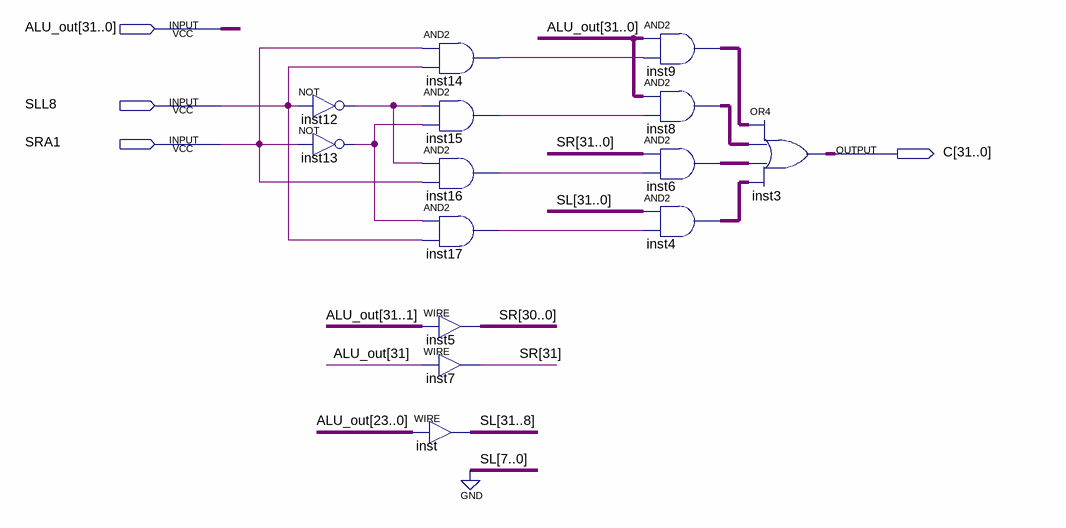
[diagram p0: schematic sheet]
// Quartus schematic SHIFTER.bdf as structural Verilog: 14 symbols, 4 pins
module SHIFTER (
  input  [31:0] ALU_out,
  input  SLL8,
  input  SRA1,
  output [31:0] C
);

  wire inst12_out, inst13_out, inst14_out, inst15_out, inst16_out, inst17_out;
  wire [31:0] inst4_out, inst6_out, inst8_out, inst9_out, SR;
  wire [31:8] SL;

  not inst12 (inst12_out, SLL8);
  not inst13 (inst13_out, SRA1);
  and inst14 (inst14_out, SRA1, SLL8);
  and inst15 (inst15_out, inst12_out, inst13_out);
  and inst16 (inst16_out, inst12_out, SRA1);
  and inst17 (inst17_out, inst13_out, SLL8);
  assign SR[30:0] = ALU_out[31:1];  // WIRE inst5
  assign SR[31] = ALU_out[31];  // WIRE inst7
  assign SL = ALU_out[23:0];  // WIRE inst
  assign inst9_out = ALU_out & {32{inst14_out}};  // AND2 inst9, 32 bits wide
  assign inst8_out = ALU_out & {32{inst15_out}};  // AND2 inst8, 32 bits wide
  assign inst6_out = SR & {32{inst16_out}};  // AND2 inst6, 32 bits wide
  assign inst4_out = {SL, {8{1'b0}}} & {32{inst17_out}};  // AND2 inst4, 32 bits wide
  assign C = inst9_out | inst8_out | inst6_out | inst4_out;  // OR4 inst3, 32 bits wide
endmodule
